# EAGLE schematic BACKPLANE_CUSTOM_CORRECTION (EAGLE 9.6.2)
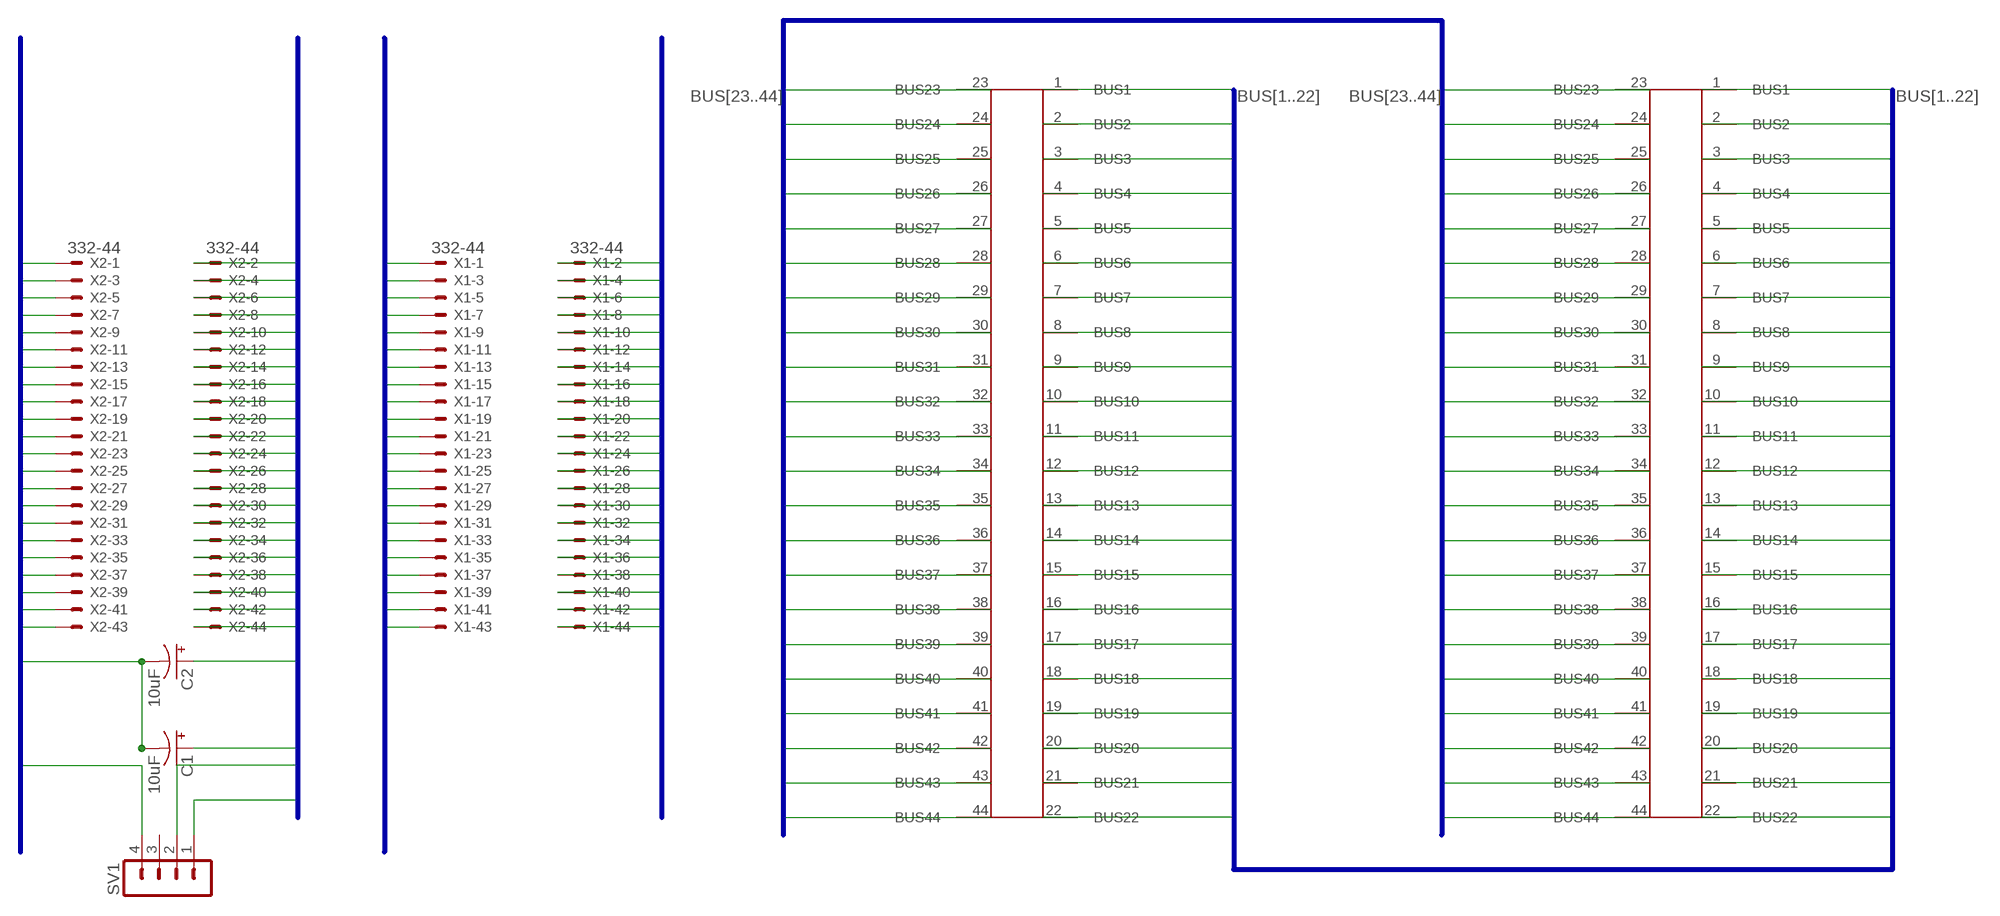
[diagram p0: schematic, sheet 1]

## Parts
C1  10uF  10UF-POLAR-RADIAL-2.5MM-25V-20%  [CPOL-RADIAL-2.5MM-5MM]
C2  10uF  10UF-POLAR-RADIAL-2.5MM-25V-20%  [CPOL-RADIAL-2.5MM-5MM]
SV1  MA04-1  [MA04-1]
U$2  22EDGECONNECTOR  [22EDGECONNECTOR]
U$3  22EDGECONNECTOR  [22EDGECONNECTOR]
X1  332-44  [332-44]
X2  332-44  [332-44]

## Nets
BUS1: U$2.1(BUS1) U$3.1(BUS1) X1.2 X2.2
BUS2: U$2.2(BUS2) U$3.2(BUS2) X1.4 X2.4
BUS3: U$2.3(BUS3) U$3.3(BUS3) X1.6 X2.6
BUS4: U$2.4(BUS4) U$3.4(BUS4) X1.8 X2.8
BUS5: U$2.5(BUS5) U$3.5(BUS5) X1.10 X2.10
BUS6: U$2.6(BUS6) U$3.6(BUS6) X1.12 X2.12
BUS7: U$2.7(BUS7) U$3.7(BUS7) X1.14 X2.14
BUS8: U$2.8(BUS8) U$3.8(BUS8) X1.16 X2.16
BUS9: U$2.9(BUS9) U$3.9(BUS9) X1.18 X2.18
BUS10: U$2.10(BUS10) U$3.10(BUS10) X1.20 X2.20
BUS11: U$2.11(BUS11) U$3.11(BUS11) X1.22 X2.22
BUS12: U$2.12(BUS12) U$3.12(BUS12) X1.24 X2.24
BUS13: U$2.13(BUS13) U$3.13(BUS13) X1.26 X2.26
BUS14: U$2.14(BUS14) U$3.14(BUS14) X1.28 X2.28
BUS15: U$2.15(BUS15) U$3.15(BUS15) X1.30 X2.30
BUS16: U$2.16(BUS16) U$3.16(BUS16) X1.32 X2.32
BUS17: U$2.17(BUS17) U$3.17(BUS17) X1.34 X2.34
BUS18: U$2.18(BUS18) U$3.18(BUS18) X1.36 X2.36
BUS19: U$2.19(BUS19) U$3.19(BUS19) X1.38 X2.38
BUS20: U$2.20(BUS20) U$3.20(BUS20) X1.40 X2.40
BUS21: C1.1(+) SV1.2 U$2.21(BUS21) U$3.21(BUS21) X1.42 X2.42
BUS22: C2.1(+) SV1.1 U$2.22(BUS22) U$3.22(BUS22) X1.44 X2.44
BUS23: U$2.23(BUS23) U$3.23(BUS23) X1.1 X2.1
BUS24: U$2.24(BUS24) U$3.24(BUS24) X1.3 X2.3
BUS25: U$2.25(BUS25) U$3.25(BUS25) X1.5 X2.5
BUS26: U$2.26(BUS26) U$3.26(BUS26) X1.7 X2.7
BUS27: U$2.27(BUS27) U$3.27(BUS27) X1.9 X2.9
BUS28: U$2.28(BUS28) U$3.28(BUS28) X1.11 X2.11
BUS29: U$2.29(BUS29) U$3.29(BUS29) X1.13 X2.13
BUS30: U$2.30(BUS30) U$3.30(BUS30) X1.15 X2.15
BUS31: U$2.31(BUS31) U$3.31(BUS31) X1.17 X2.17
BUS32: U$2.32(BUS32) U$3.32(BUS32) X1.19 X2.19
BUS33: U$2.33(BUS33) U$3.33(BUS33) X1.21 X2.21
BUS34: U$2.34(BUS34) U$3.34(BUS34) X1.23 X2.23
BUS35: U$2.35(BUS35) U$3.35(BUS35) X1.25 X2.25
BUS36: U$2.36(BUS36) U$3.36(BUS36) X1.27 X2.27
BUS37: U$2.37(BUS37) U$3.37(BUS37) X1.29 X2.29
BUS38: U$2.38(BUS38) U$3.38(BUS38) X1.31 X2.31
BUS39: U$2.39(BUS39) U$3.39(BUS39) X1.33 X2.33
BUS40: U$2.40(BUS40) U$3.40(BUS40) X1.35 X2.35
BUS41: U$2.41(BUS41) U$3.41(BUS41) X1.37 X2.37
BUS42: U$2.42(BUS42) U$3.42(BUS42) X1.39 X2.39
BUS43: U$2.43(BUS43) U$3.43(BUS43) X1.41 X2.41
BUS44: C1.2(-) C2.2(-) SV1.4 U$2.44(BUS44) U$3.44(BUS44) X1.43 X2.43
Unconnected: SV1.3

## Buses
BUS[1..22]
BUS[23..44]

## Library data of the parts
C1 C2 = SparkFun-Capacitors:10UF-POLAR: 10.0µF polarized capacitors A capacitor is a passive two-terminal electrical component used to store electrical energy temporarily in an electric field.; PROD_ID: CAP-08440
SV1 = con-lstb:MA04-1: PIN HEADER; OC_FARNELL: unknown; OC_NEWARK: unknown
U$2 U$3 = 22edge:22EDGECONNECTOR
X1 X2 = con-garry:332-44: 44 Pin - 2mm Dual Row Source: www.mpe-connector.de / garry_shortform_2012.pdf